# EAGLE design GA144_SRAM_ISI_V2 (EAGLE 5.07)
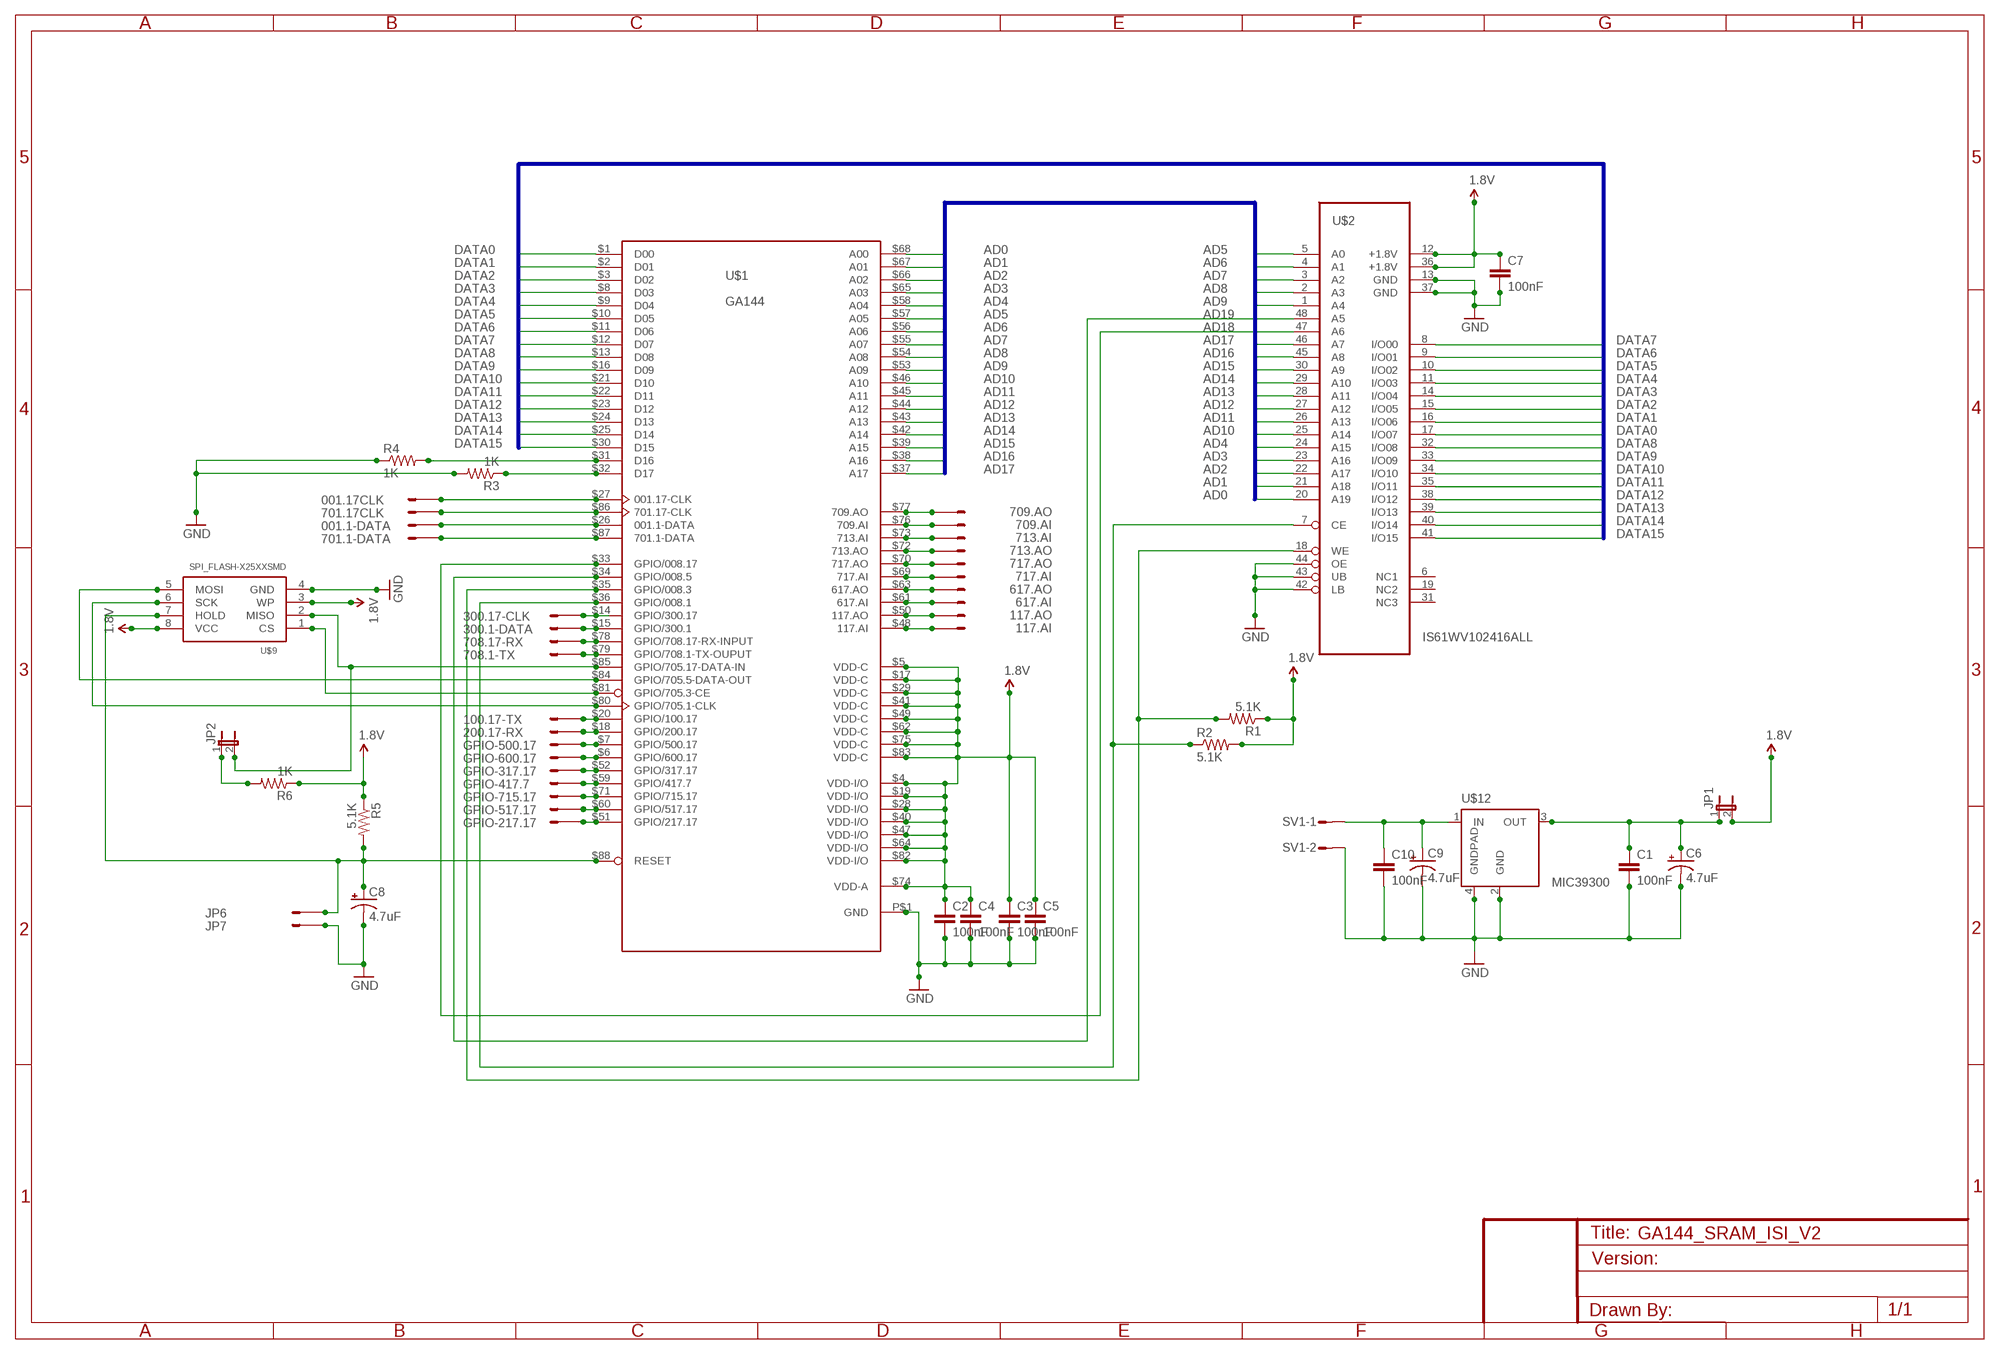
[diagram p0: schematic, sheet 1]

## Parts
001.1-DATA  M01PTH_LONGPAD  [1X01_LONGPAD]
001.17CLK  M01PTH_LONGPAD  [1X01_LONGPAD]
100.17-TX  M01PTH_LONGPAD  [1X01_LONGPAD]
117.AI  M01PTH_LONGPAD  [1X01_LONGPAD]
117.AO  M01PTH_LONGPAD  [1X01_LONGPAD]
200.17-RX  M01PTH_LONGPAD  [1X01_LONGPAD]
300.1-DATA  M01PTH_LONGPAD  [1X01_LONGPAD]
300.17-CLK  M01PTH_LONGPAD  [1X01_LONGPAD]
617.AI  M01PTH_LONGPAD  [1X01_LONGPAD]
617.AO  M01PTH_LONGPAD  [1X01_LONGPAD]
701.1-DATA  M01PTH_LONGPAD  [1X01_LONGPAD]
701.17CLK  M01PTH_LONGPAD  [1X01_LONGPAD]
708.1-TX  M01PTH_LONGPAD  [1X01_LONGPAD]
708.17-RX  M01PTH_LONGPAD  [1X01_LONGPAD]
709.AI  M01PTH_LONGPAD  [1X01_LONGPAD]
709.AO  M01PTH_LONGPAD  [1X01_LONGPAD]
713.AI  M01PTH_LONGPAD  [1X01_LONGPAD]
713.AO  M01PTH_LONGPAD  [1X01_LONGPAD]
717.AI  M01PTH_LONGPAD  [1X01_LONGPAD]
717.AO  M01PTH_LONGPAD  [1X01_LONGPAD]
C1  100nF  CAP1210  [1210]
C2  100nF  CAP0402-CAP  [0402-CAP]
C3  100nF  CAP0402-CAP  [0402-CAP]
C4  100nF  CAP0402-CAP  [0402-CAP]
C5  100nF  CAP0402-CAP  [0402-CAP]
C6  4.7uF  CAP_POLSMD  [VISHAY_C]
C7  100nF  CAP1210  [1210]
C8  4.7uF  CAP_POLSMD  [VISHAY_C]
C9  4.7uF  CAP_POLSMD  [VISHAY_C]
C10  100nF  CAP1210  [1210]
GPIO-217.17  M01PTH_LONGPAD  [1X01_LONGPAD]
GPIO-317.17  M01PTH_LONGPAD  [1X01_LONGPAD]
GPIO-417.7  M01PTH_LONGPAD  [1X01_LONGPAD]
GPIO-500.17  M01PTH_LONGPAD  [1X01_LONGPAD]
GPIO-517.17  M01PTH_LONGPAD  [1X01_LONGPAD]
GPIO-600.17  M01PTH_LONGPAD  [1X01_LONGPAD]
GPIO-715.17  M01PTH_LONGPAD  [1X01_LONGPAD]
JP1  JP1E  [JP1]
JP2  JP1E  [JP1]
JP6  M01PTH_LONGPAD  [1X01_LONGPAD]
JP7  M01PTH_LONGPAD  [1X01_LONGPAD]
R1  5.1K  RESISTOR1206  [1206]
R2  5.1K  RESISTOR1206  [1206]
R3  1K  RESISTOR1206  [1206]
R4  1K  RESISTOR1206  [1206]
R5  5.1K  RESISTOR1206  [1206]
R6  1K  RESISTOR1206  [1206]
SV1  L02P  [L02P]
U$1  GA144  GA144_NEW  [QFN88-0.4MM]
U$2  IS61WV102416ALL  [TSOP-48]
U$9  SPI_FLASH-X25XXSMD  [SO08]
U$12  MIC39300  [TO263-3]

## Nets
1.8V: C2.1 C3.1 C4.1 C5.1 C7.1 JP1.2 R1.1 R2.2 R5.1 R6.1 U$1.$4(VDD-I/O) U$1.$5(VDD-C) U$1.$17(VDD-C) U$1.$19(VDD-I/O) U$1.$28(VDD-I/O) U$1.$29(VDD-C) U$1.$40(VDD-I/O) U$1.$41(VDD-C) U$1.$47(VDD-I/O) U$1.$49(VDD-C) U$1.$62(VDD-C) U$1.$64(VDD-I/O) U$1.$74(VDD-A) U$1.$75(VDD-C) U$1.$82(VDD-I/O) U$1.$83(VDD-C) U$2.12(+1.8V) U$2.36(+1.8V) U$9.3(WP) U$9.8(VCC)
AD0: U$1.$68(A00) U$2.20(A19)
AD1: U$1.$67(A01) U$2.21(A18)
AD2: U$1.$66(A02) U$2.22(A17)
AD3: U$1.$65(A03) U$2.23(A16)
AD4: U$1.$58(A04) U$2.24(A15)
AD5: U$1.$57(A05) U$2.5(A0)
AD6: U$1.$56(A06) U$2.4(A1)
AD7: U$1.$55(A07) U$2.3(A2)
AD8: U$1.$54(A08) U$2.2(A3)
AD9: U$1.$53(A09) U$2.1(A4)
AD10: U$1.$46(A10) U$2.25(A14)
AD11: U$1.$45(A11) U$2.26(A13)
AD12: U$1.$44(A12) U$2.27(A12)
AD13: U$1.$43(A13) U$2.28(A11)
AD14: U$1.$42(A14) U$2.29(A10)
AD15: U$1.$39(A15) U$2.30(A9)
AD16: U$1.$38(A16) U$2.45(A8)
AD17: U$1.$37(A17) U$2.46(A7)
AD18: U$1.$33(GPIO/008.17) U$2.47(A6)
AD19: U$1.$34(GPIO/008.5) U$2.48(A5)
DATA0: U$1.$1(D00) U$2.17(I/O07)
DATA1: U$1.$2(D01) U$2.16(I/O06)
DATA2: U$1.$3(D02) U$2.15(I/O05)
DATA3: U$1.$8(D03) U$2.14(I/O04)
DATA4: U$1.$9(D04) U$2.11(I/O03)
DATA5: U$1.$10(D05) U$2.10(I/O02)
DATA6: U$1.$11(D06) U$2.9(I/O01)
DATA7: U$1.$12(D07) U$2.8(I/O00)
DATA8: U$1.$13(D08) U$2.32(I/O08)
DATA9: U$1.$16(D09) U$2.33(I/O09)
DATA10: U$1.$21(D10) U$2.34(I/O10)
DATA11: U$1.$22(D11) U$2.35(I/O11)
DATA12: U$1.$23(D12) U$2.38(I/O12)
DATA13: U$1.$24(D13) U$2.39(I/O13)
DATA14: U$1.$25(D14) U$2.40(I/O14)
DATA15: U$1.$30(D15) U$2.41(I/O15)
GND: C1.2 C2.2 C3.2 C4.2 C5.2 C6.- C7.2 C8.- C9.- C10.2 JP7.1 R3.2 R4.1 SV1.2 U$1.P$1(GND) U$2.13(GND) U$2.37(GND) U$2.42(LB) U$2.43(UB) U$2.44(OE) U$9.4(GND) U$12.2(GND) U$12.4(GNDPAD)
N$1: JP2.1 R6.2
N$4: R1.2 U$1.$35(GPIO/008.3) U$2.18(WE)
N$5: R2.1 U$1.$36(GPIO/008.1) U$2.7(CE)
N$6: R3.1 U$1.$32(D17)
N$7: R4.2 U$1.$31(D16)
N$8: C8.+ JP6.1 R5.2 U$1.$88(RESET) U$9.7(HOLD)
N$9: U$1.$81(GPIO/705.3-CE) U$9.1(CS)
N$10: JP2.2 U$1.$85(GPIO/705.17-DATA-IN) U$9.2(MISO)
N$11: U$1.$84(GPIO/705.5-DATA-OUT) U$9.5(MOSI)
N$12: U$1.$80(GPIO/705.1-CLK) U$9.6(SCK)
N$13: 701.17CLK.1 U$1.$86(701.17-CLK)
N$14: C9.+ C10.1 SV1.1 U$12.1(IN)
N$15: C1.1 C6.+ JP1.1 U$12.3(OUT)
N$16: 709.AI.1 U$1.$76(709.AI)
N$17: 709.AO.1 U$1.$77(709.AO)
N$18: 713.AI.1 U$1.$73(713.AI)
N$19: 713.AO.1 U$1.$72(713.AO)
N$20: 717.AO.1 U$1.$70(717.AO)
N$21: 717.AI.1 U$1.$69(717.AI)
N$22: 617.AO.1 U$1.$63(617.AO)
N$23: 617.AI.1 U$1.$61(617.AI)
N$24: 117.AO.1 U$1.$50(117.AO)
N$25: 117.AI.1 U$1.$48(117.AI)
N$26: 001.17CLK.1 U$1.$27(001.17-CLK)
N$27: 001.1-DATA.1 U$1.$26(001.1-DATA)
N$28: 300.17-CLK.1 U$1.$14(GPIO/300.17)
N$29: 701.1-DATA.1 U$1.$87(701.1-DATA)
N$30: 300.1-DATA.1 U$1.$15(GPIO/300.1)
N$31: 708.17-RX.1 U$1.$78(GPIO/708.17-RX-INPUT)
N$32: 708.1-TX.1 U$1.$79(GPIO/708.1-TX-OUPUT)
N$33: 100.17-TX.1 U$1.$20(GPIO/100.17)
N$34: 200.17-RX.1 U$1.$18(GPIO/200.17)
N$35: GPIO-500.17.1 U$1.$7(GPIO/500.17)
N$36: GPIO-600.17.1 U$1.$6(GPIO/600.17)
N$37: GPIO-317.17.1 U$1.$52(GPIO/317.17)
N$38: GPIO-417.7.1 U$1.$59(GPIO/417.7)
N$39: GPIO-715.17.1 U$1.$71(GPIO/715.17)
N$40: GPIO-517.17.1 U$1.$60(GPIO/517.17)
N$41: GPIO-217.17.1 U$1.$51(GPIO/217.17)
Unconnected: U$2.6(NC1) U$2.19(NC2) U$2.31(NC3)

## Buses
DATA[0..15]
AD[0..19]

## Library data of the parts
001.1-DATA 001.17CLK 100.17-TX 117.AI 117.AO 200.17-RX 300.1-DATA 300.17-CLK 617.AI 617.AO 701.1-DATA 701.17CLK 708.1-TX 708.17-RX 709.AI 709.AO 713.AI 713.AO 717.AI 717.AO GPIO-217.17 GPIO-317.17 GPIO-417.7 GPIO-500.17 GPIO-517.17 GPIO-600.17 GPIO-715.17 JP6 JP7 = ga144:M01: Header 1 Standard 1-pin 0.1" header. Use with straight break away headers (SKU : PRT-00116), right angle break away headers (PRT-00553), swiss pins (PRT-00743), machine pins (PRT-00117), and female headers (PRT-00115).
C1-C5 C7 C10 = SparkFun:CAP: Capacitor Standard 0603 ceramic capacitor, and 0.1" leaded capacitor.
C6 C8 C9 = SparkFun:CAP_POL: Capacitor Polarized These are standard SMD and PTH capacitors. Normally 10uF, 47uF, and 100uF in electrolytic and tantalum varieties. Always verify the external diameter of the through hole cap, it varies with capacity, voltage, and manufacturer. The EIA devices should be standard.
JP1 JP2 = jumper:JP1E: JUMPER
R1-R6 = QFN:RESISTOR: Resistor Basic schematic elements and footprints for 0603, 1206, and PTH 1/10th watt (small) resistors.
SV1 = con-amp-mt:L02P: AMP MT CONNECTOR; OC_FARNELL: unknown; OC_NEWARK: unknown
U$1 = ga144:GA144_NEW: Parallel Processing for Embedded Systems The GA144 measures just 1cm x 1cm. It integrates 144 F18A computers in an 18 x 8 array. # Each of its F18A computers can perform a basic ALU function in about 1.5 nanoseconds while only consuming about 7 picojoules. http://greenarraychips.com/ library GA144 eagle : http://esaid.free.fr/
U$2 = ga144:IS61WV102416ALL: IS61WV102416ALL SRAM 1.8V 20ns
U$9 = SparkFun:SPI_FLASH-X25XX: 8pin SPI Flash series x25xx. Works with devices like W25X32 and BR25L32
U$12 = v-reg-micrel:MIC39300: MIC39300 LDO regulateur MICREL : www.micrel.com/_PDF/mic39300.pdf

## Board
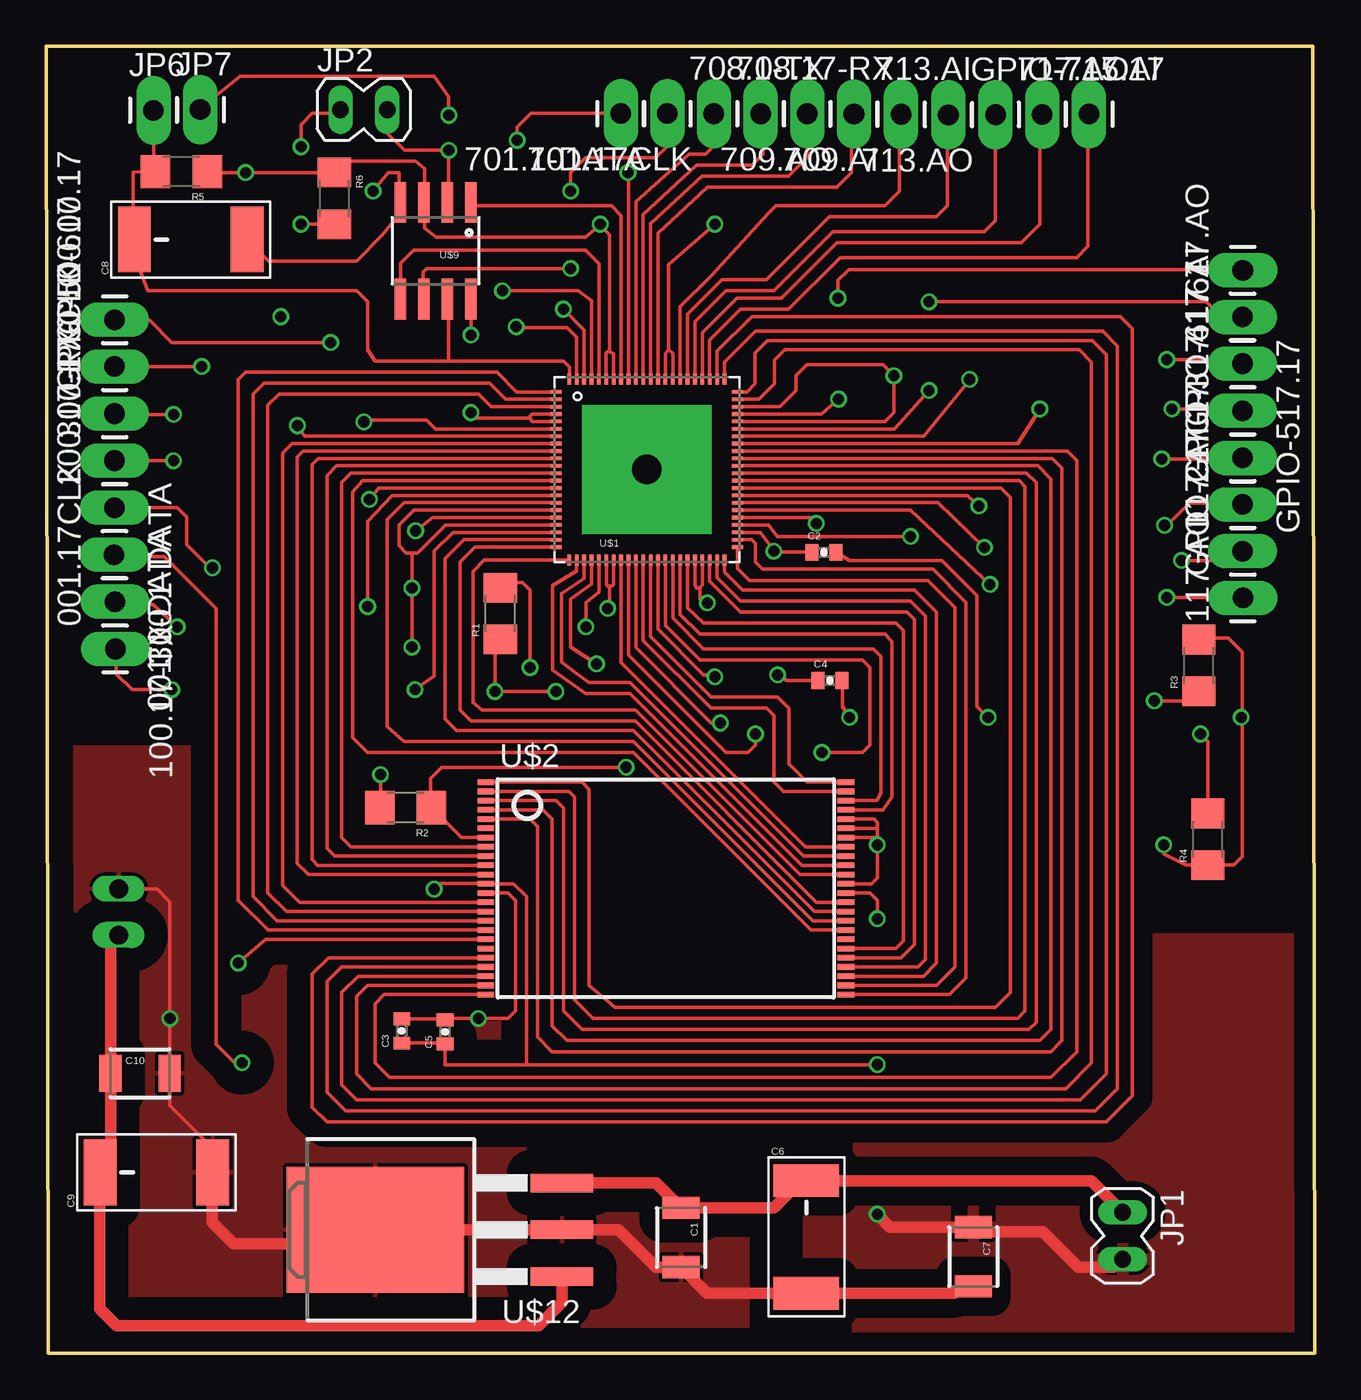
[diagram p1: board, top side]
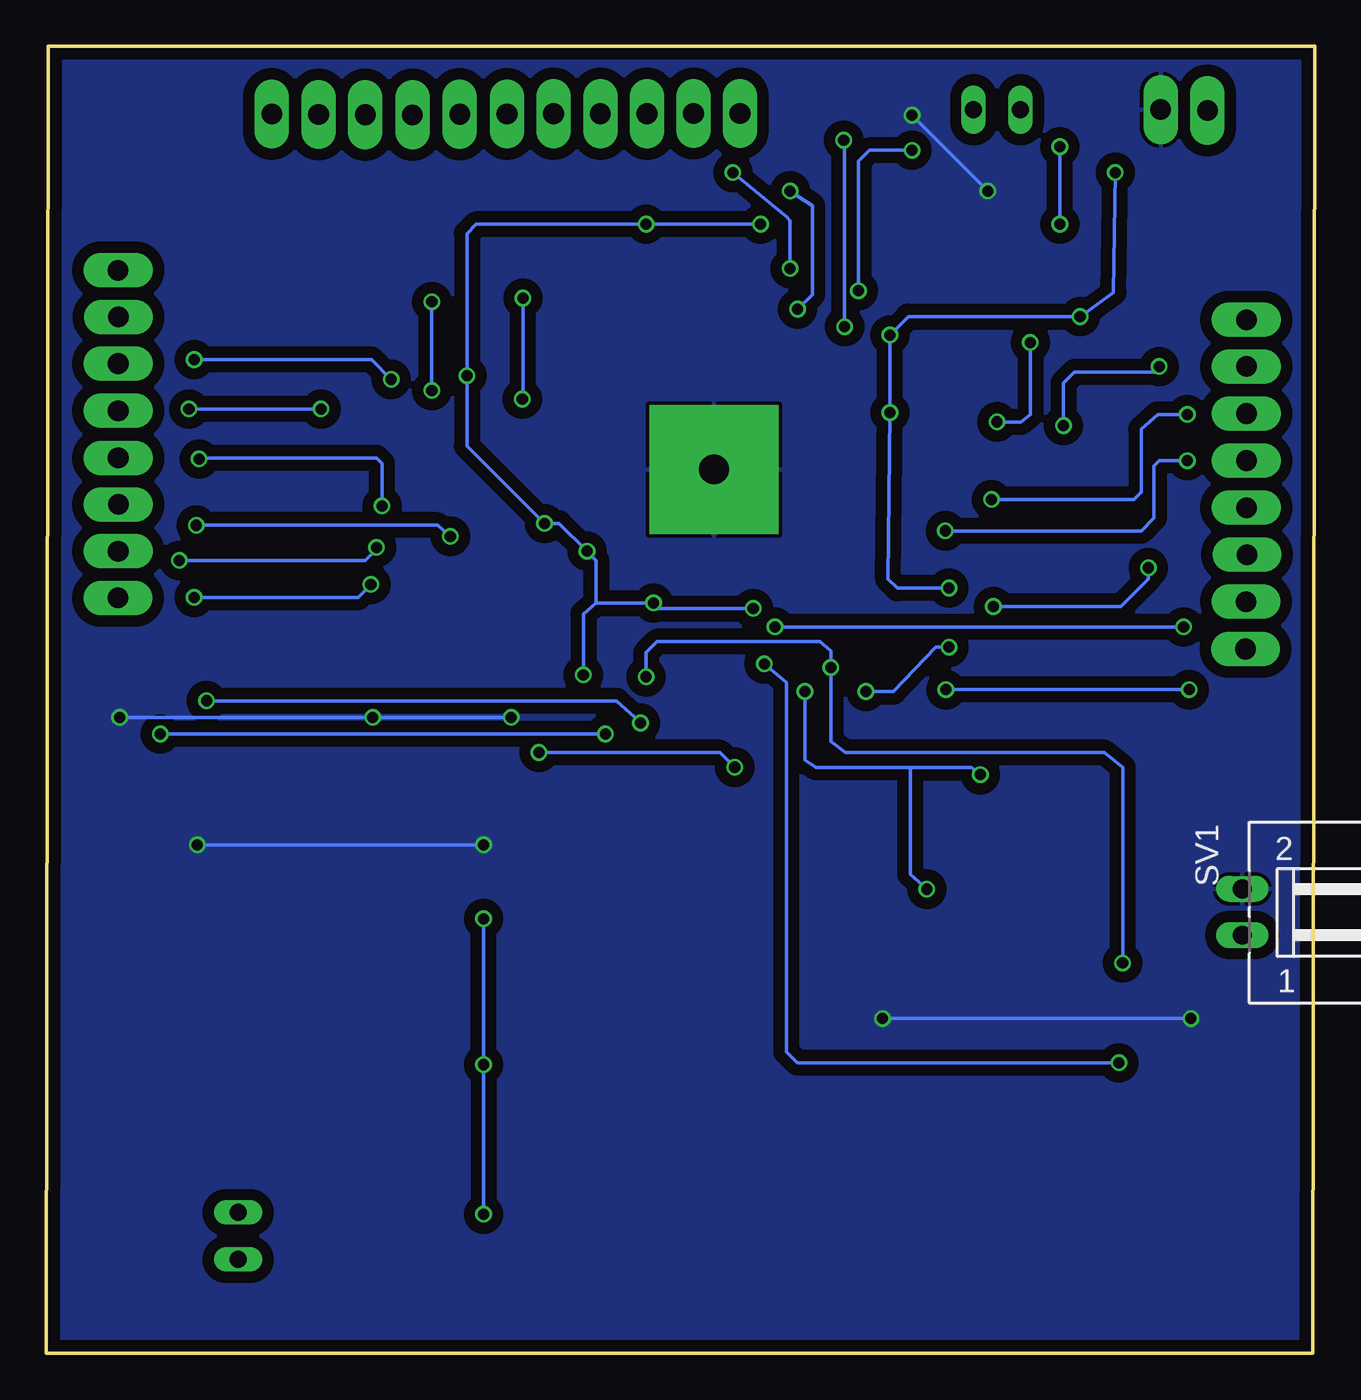
[diagram p2: board, bottom side, seen from below]

Size 68.68 x 70.77 mm. Coordinates in mm from the lower left corner, seen from the top.
Outline: 0,70.77 68.58,70.77 68.68,0 0.1,0 0,70.77
Copper layers (1*16): Top 0.035mm / dielectric 1.5mm / Bottom 0.035mm
Design rules "PCB-POOL Standard": minimum track width 0.15mm, minimum drill 0.3mm, track to track 0.15mm, track to pad 0.15mm, pad to pad 0.15mm, via to via 0.15mm, smd to smd 0.15mm, copper to edge 0.3mm, drill to drill 0.2mm, minimum pad ring 0.2mm, minimum via ring 0.15mm, stop-mask expansion 0.075mm, vias tented up to drill 0mil, thermal gap 0.2mm

### Footprints (pad centres in the part's own frame; a part is rotated, then mirrored left to right if it is on the bottom)
1X01_LONGPAD = drill 1.118 pad 1.88 long: 1 0,0
1210 = smd 1.2 x 2: 1 -1.6,0; 2 1.6,0
0402-CAP = smd 0.7 x 0.9: 1 -0.65,0; 2 0.65,0
VISHAY_C = smd 3.556 x 1.778: + 0,3.048; - 0,-3.048
JP1 = drill 0.914 long: 1 0,-1.27; 2 0,1.27
1206 = smd 1.6 x 1.8: 1 -1.4,0; 2 1.4,0
L02P = drill 1.016 long: 1 1.25,-6.25; 2 -1.25,-6.25
QFN88-0.4MM = smd 0.6 x 0.2: $1 -5.21,4.3; $2 -5.21,3.9; $3 -5.21,3.5; $4 -5.21,3.1; $5 -5.21,2.7; $6 -5.21,2.3; $7 -5.21,1.9; $8 -5.21,1.5; $9 -5.21,1.1; $10 -5.21,0.7; $11 -5.21,0.3; $12 -5.21,-0.1; $13 -5.21,-0.5; $14 -5.21,-0.9; $15 -5.21,-1.3; $16 -5.21,-1.7; $17 -5.21,-2.1; $18 -5.21,-2.5; $19 -5.21,-2.9; $20 -5.21,-3.3; $21 -5.21,-3.7; $22 -5.21,-4.1; $45 4.61,-4.1; $46 4.61,-3.7; $47 4.61,-3.3; $48 4.61,-2.9; $49 4.61,-2.5; $50 4.61,-2.1; $51 4.61,-1.7; $52 4.61,-1.3; $53 4.61,-0.9; $54 4.61,-0.5; $55 4.61,-0.1; $56 4.61,0.3; $57 4.61,0.7; $58 4.61,1.1; $59 4.61,1.5; $60 4.61,1.9; $61 4.61,2.3; $62 4.61,2.7; $63 4.61,3.1; $64 4.61,3.5; $65 4.61,3.9; $66 4.61,4.3 | smd 0.2 x 0.6: $23 -4.5,-4.81; $24 -4.1,-4.81; $25 -3.7,-4.81; $26 -3.3,-4.81; $27 -2.9,-4.81; $28 -2.5,-4.81; $29 -2.1,-4.81; $30 -1.7,-4.81; $31 -1.3,-4.81; $32 -0.9,-4.81; $33 -0.5,-4.81; $34 -0.1,-4.81; $35 0.3,-4.81; $36 0.7,-4.81; $37 1.1,-4.81; $38 1.5,-4.81; $39 1.9,-4.81; $40 2.3,-4.81; $41 2.7,-4.81; $42 3.1,-4.81; $43 3.5,-4.81; $44 3.9,-4.81; $67 3.9,4.99; $68 3.5,4.99; $69 3.1,4.99; $70 2.7,4.99; $71 2.3,4.99; $72 1.9,4.99; $73 1.5,4.99; $74 1.1,4.99; $75 0.7,4.99; $76 0.3,4.99; $77 -0.1,4.99; $78 -0.5,4.99; $79 -0.9,4.99; $80 -1.3,4.99; $81 -1.7,4.99; $82 -2.1,4.99; $83 -2.5,4.99; $84 -2.9,4.99; $85 -3.3,4.99; $86 -3.7,4.99; $87 -4.1,4.99; $88 -4.5,4.99 | drill 1.6 pad 7 square: P$1 -0.3,0.1
TSOP-48 = smd 0.9 x 0.3: 1 -3.4,8.29; 2 -3.4,7.79; 3 -3.4,7.29; 4 -3.4,6.79; 5 -3.4,6.29; 6 -3.4,5.79; 7 -3.4,5.29; 8 -3.4,4.79; 9 -3.4,4.29; 10 -3.4,3.79; 11 -3.4,3.29; 12 -3.4,2.79; 13 -3.4,2.29; 14 -3.4,1.79; 15 -3.4,1.29; 16 -3.4,0.79; 17 -3.4,0.29; 18 -3.4,-0.21; 19 -3.4,-0.71; 20 -3.4,-1.21; 21 -3.4,-1.71; 22 -3.4,-2.21; 23 -3.4,-2.71; 24 -3.4,-3.21; 25 16.1,-3.21; 26 16.1,-2.71; 27 16.1,-2.21; 28 16.1,-1.71; 29 16.1,-1.21; 30 16.1,-0.71; 31 16.1,-0.21; 32 16.1,0.29; 33 16.1,0.79; 34 16.1,1.29; 35 16.1,1.79; 36 16.1,2.29; 37 16.1,2.79; 38 16.1,3.29; 39 16.1,3.79; 40 16.1,4.29; 41 16.1,4.79; 42 16.1,5.29; 43 16.1,5.79; 44 16.1,6.29; 45 16.1,6.79; 46 16.1,7.29; 47 16.1,7.79; 48 16.1,8.29
SO08 = smd 0.61 x 2.21: 1 -1.905,-2.616; 2 -0.635,-2.616; 3 0.635,-2.616; 4 1.905,-2.616; 5 1.905,2.616; 6 0.635,2.616; 7 -0.635,2.616; 8 -1.905,2.616
TO263-3 = smd 1 x 3.4: 1 -3.81,-6.6; 2 -1.27,-6.6; 3 1.27,-6.6 | smd 6.8 x 9.6: 4 -1.27,3.5

### Placement (x,y rotation side)
001.1-DATA  3.67,43.24 270 top
001.17CLK  3.72,40.7 90 top
100.17-TX  3.75,38.13 270 top
117.AI  64.78,45.96 90 top
117.AO  64.8,40.91 90 top
200.17-RX  3.7,48.33 90 top
300.1-DATA  3.7,45.78 270 top
300.17-CLK  3.7,50.88 90 top
617.AI  64.77,56.11 90 top
617.AO  64.78,58.64 90 top
701.1-DATA  31.11,67.12 180 top
701.17CLK  33.63,67.12 180 top
708.1-TX  36.15,67.11 0 top
708.17-RX  38.68,67.11 0 top
709.AI  43.73,67.09 180 top
709.AO  41.21,67.11 180 top
713.AI  46.28,67.08 0 top
713.AO  48.85,67.05 180 top
717.AI  56.46,67.09 0 top
717.AO  53.92,67.08 0 top
C1  34.37,6.28 270 top
C2  42.11,43.37 0 top
C3  19.25,17.45 90 top
C4  42.45,36.43 0 top
C5  21.6,17.4 90 top
C6  41.15,6.3 0 top
C7  50.2,5.23 270 top
C8  7.83,60.3 90 top
C9  5.97,9.8 90 top
C10  5.08,15.16 0 top
GPIO-217.17  64.78,43.43 90 top
GPIO-317.17  64.78,48.48 90 top
GPIO-417.7  64.78,51.03 90 top
GPIO-500.17  3.7,53.43 90 top
GPIO-517.17  64.78,53.58 270 top
GPIO-600.17  3.7,55.96 90 top
GPIO-715.17  51.4,67.06 0 top
JP1  58.28,6.36 180 top
JP2  17.2,67.33 270 top
JP6  5.81,67.3 0 top
JP7  8.34,67.33 0 top
R1  24.59,40.05 90 top
R2  19.46,29.54 180 top
R3  62.41,37.24 90 top
R4  62.9,27.83 90 top
R5  7.32,63.98 180 top
R6  15.6,62.53 270 top
SV1  -2.33,23.89 270 bottom
U$1  32.83,47.75 0 top
U$2  27.2,22.63 0 top
U$9  21.09,59.69 180 top
U$12  21.32,7.96 90 top

### Tracks (layer width: path | path; a pad name or v marks a point on that pad's centre or on a via)
1.8V  (via drill 0.6)
  Top 0.2: U$1.$64 39.72,51.25 40.6,52.13 40.6,52.93 41.2,53.53 45.3,53.53 v45.9,52.93 45.9,50.93 45.42,50.45 U$1.$62 | U$1.$47 38.68,44.45 39.45,43.38 | 41.4,43.53 C2.1 41.25,43.38 39.45,43.38 | U$9.3 20.5,62.86 20.5,64.13 20,64.53 15.6,64.53 R6.1 | 15.25,64.28 15.05,64.48 | 15.25,64.28 R6.1 | U$9.3 20.4,62.33 | 26.2,50.63 26.31,50.45 U$1.$5 | 26.2,50.63 26.2,50.73 26.3,50.85 U$1.$4 | 30.5,54.23 30.72,54.13 30.72,52.83 U$1.$82 | 30.5,54.23 30.4,54.23 30.32,54.14 30.32,52.84 U$1.$83 | 33.7,54.33 33.93,54.13 33.93,52.83 U$1.$74 | 33.7,54.33 33.53,54.13 33.53,52.83 U$1.$75 | 35.4,41.43 35.2,41.43 35.12,41.63 U$1.$40 | U$1.$41 35.53,41.63 35.4,41.43 | 30.65,41.58 30.6,41.53 30.5,41.53 | 30.65,41.58 30.73,41.63 U$1.$29 | 30.5,41.53 30.4,41.53 30.33,41.63 U$1.$28 | R6.1 15.55,63.98 | v23,55.13 23,56.93 U$9.8 | v23,50.93 23.3,50.63 26.2,50.63 | R5.1 8.8,63.93 v10.8,63.93 14.9,63.93 15.25,64.28 | 30.5,54.23 30.5,60.53 v30,61.13 29.9,61.03 29.2,60.43 21.1,60.43 20.5,60.93 20.5,62.23 U$9.3 | v36.2,61.13 33.7,58.93 33.7,54.33 | U$1.$19 21.62,44.85 20.1,43.33 19.8,43.33 | U$1.$17 19.92,45.65 19.1,44.83 19.1,43.73 19.5,43.33 19.8,43.33 | v39.6,36.73 40.1,36.43 C4.1 | 35.4,41.43 35.4,40.83 v35.8,40.63 | 30.5,41.53 30.5,40.46 v30.4,40.33 | 30.5,41.53 30.65,41.58 | 26,15.63 26,24.73 25.31,25.42 U$2.12 21.3,25.43 v21,25.13 | 26,15.63 21.6,15.63 C5.1 21.55,16.8 C3.1 | v45,23.53 45,24.53 44.6,24.93 43.4,24.93 U$2.36 | v19.8,38.23 v19.8,41.43 19.8,43.33 | v27.6,35.83 v24.3,35.83 24.3,38.36 R1.1 | v18.1,31.33 18.1,29.63 R2.2 | v39.4,43.43 39.45,43.38 | U$1.$49 41.5,45.25 41.7,45.03 v41.7,44.93 | 26,15.63 v45,15.63
  Top 0.61: JP1.2 57.78,4.67 55.88,4.67 53.98,6.57 50.8,6.57 C7.1 45.7,6.84 v45,7.53
  Bottom 0.2: v10.8,63.93 10.9,57.43 v12.7,56.13 22,56.13 v23,55.13 v23,50.93 23.1,41.93 22.6,41.43 v19.8,41.43 | v39.6,36.73 39.6,40.03 38.9,40.63 | 38.9,40.63 v35.8,40.63 35.5,40.33 v30.4,40.33 | v45,7.53 v45,15.63 v45,23.53 | v19.8,38.23 20.5,38.23 22.8,35.83 v24.3,35.83 | v27.6,35.83 27.6,32.13 27,31.73 21.9,31.73 | 21.9,31.73 18.6,31.73 v18.1,31.33 | 38.9,40.63 38.9,42.93 v39.4,43.43 40.9,44.93 v41.7,44.93 45.9,49.13 v45.9,52.93 45.9,60.63 45.4,61.13 v36.2,61.13 v30,61.13 | 21.9,31.73 21.9,25.93 v21,25.13
  pour Top (isolate 1.016): 67.94,0.22 67.94,22.45 42.55,22.45 41.27,21.17 41.27,0.86 41.91,0.22
AD0
  Top 0.2: U$2.20 15.29,21.42 14.4,20.53 14.4,13.33 15.2,12.53 57.4,12.53 58.8,13.93 58.8,55.48 58.15,56.13 38.2,56.13 36.33,54.25 U$1.$68
AD1
  Top 0.2: U$1.$67 36.73,53.66 38.4,55.33 57.2,55.33 58,54.53 58,14.33 56.8,13.13 16.2,13.13 15.2,14.13 15.2,20.13 15.99,20.92 U$2.21
AD2
  Top 0.2: U$2.22 16.89,20.42 16,19.53 16,14.53 16.8,13.73 56,13.73 57.4,15.13 57.4,54.07 56.64,54.83 39.04,54.83 38.37,54.16 38.37,52.49 37.93,52.05 U$1.$66
AD3
  Top 0.2: U$2.23 17.39,19.92 16.8,19.33 16.8,15.13 17.6,14.33 55.2,14.33 56.6,15.73 56.6,53.67 55.94,54.33 40,54.33 39.44,53.77 39.44,52.49 38.6,51.65 U$1.$65
AD4
  Top 0.2: U$2.24 18.29,19.42 17.8,18.93 17.8,15.73 18.6,14.93 54.4,14.93 55.8,16.33 55.8,48.33 55.28,48.85 U$1.$58
AD5
  Top 0.2: U$2.5 26.21,28.92 26.6,28.53 26.6,17.13 27.4,16.33 54.4,16.33 55,16.93 55,47.93 54.48,48.45 U$1.$57
AD6
  Top 0.2: U$1.$56 53.68,48.05 54.4,47.33 54.4,17.53 53.8,16.93 28.2,16.93 27.4,17.73 27.4,28.93 26.91,29.42 U$2.4
AD7
  Top 0.2: U$2.3 27.61,29.92 28,29.53 28,18.53 29,17.53 53.2,17.53 53.6,17.93 53.6,47.13 53.08,47.65 U$1.$55
AD8
  Top 0.2: U$1.$54 52.68,47.25 53,46.93 53,18.53 52.6,18.13 29.6,18.13 28.6,19.13 28.6,30.13 28.31,30.42 U$2.2
AD9
  Top 0.2: U$2.1 29.01,30.92 29.4,30.53 29.4,19.93 30.8,18.73 51.4,18.73 52.2,19.53 52.2,46.33 51.68,46.85 U$1.$53
AD10
  Top 0.2: U$2.25 48.89,19.42 49.8,20.33 49.8,40.66 48.01,42.45 38.78,42.45 38.4,42.83 38.4,43.83 38.18,44.05 U$1.$46
AD11
  Top 0.2: U$1.$45 37.44,42.49 38.08,41.85 47.74,41.85 49.2,40.39 49.2,20.93 48.19,19.92 U$2.26
AD12
  Top 0.2: U$1.$44 36.73,42.3 37.7,41.33 47,41.33 48.2,40.13 48.2,21.13 47.49,20.42 U$2.27
AD13
  Top 0.2: U$1.$43 36.33,42 37.6,40.73 46.8,40.73 47.6,39.93 47.6,21.33 47.19,20.92 U$2.28
AD14
  Top 0.2: U$1.$42 35.92,41.8 37.6,40.13 46.6,40.13 47,39.73 47,22.13 46.29,21.42 U$2.29
AD15
  Top 0.2: U$1.$39 34.73,40.35 35.6,39.53 46,39.53 46.4,39.13 46.4,22.33 46,21.93 U$2.30
AD16
  Top 0.2: U$1.$38 34.33,40 35.4,38.93 45.4,38.93 45.8,38.53 45.8,30.13 45.29,29.42 U$2.45
AD17
  Top 0.2: U$1.$37 33.92,39.8 35.6,38.13 44.8,38.13 45.2,37.73 45.2,30.33 44.99,29.92 U$2.46
AD18
  Top 0.2: U$2.47 39.91,30.42 39.4,30.93 39.4,34.53 39,34.93 36,34.93 32.33,38.6 U$1.$33
AD19
  Top 0.2: U$1.$34 32.73,38.8 36,35.53 39.6,35.53 40.21,34.92 40.21,31.92 41.2,30.93 41.4,30.93 U$2.48
DATA0
  Top 0.2: U$2.17 12.01,22.92 10.4,24.53 10.4,52.73 10.8,53.13 24.4,53.13 25.48,52.05 U$1.$1
DATA1
  Top 0.2: U$2.16 12.51,23.42 11.2,24.73 11.2,51.93 11.8,52.53 24,52.53 24.88,51.65 U$1.$2
DATA2
  Top 0.2: U$1.$3 24.08,51.25 23.4,51.93 12.6,51.93 12,51.33 12,24.93 13.01,23.92 U$2.15
DATA3
  Top 0.2: U$1.$8 13.32,49.25 12.8,48.73 12.8,25.33 13.71,24.42 U$2.14
DATA4
  Top 0.2: U$1.$9 13.92,48.85 13.6,48.53 13.6,26.53 14.21,25.92 U$2.11
DATA5
  Top 0.2: U$1.$10 14.72,48.45 14.4,48.13 14.4,26.73 14.71,26.42 U$2.10
DATA6
  Top 0.2: U$1.$11 15.72,48.05 15.2,47.53 15.2,27.33 15.61,26.92 U$2.9
DATA7
  Top 0.2: U$1.$12 16.52,47.65 16,47.13 16,27.93 16.51,27.42 U$2.8
DATA8
  Top 0.2: U$1.$13 17.12,47.25 16.6,46.63 16.6,33.33 17.4,32.53 31.8,32.53 41.4,22.93 43.2,22.93 U$2.32
DATA9
  Top 0.2: U$1.$16 19.39,46.05 18.47,45.13 18.47,33.93 19.37,33.13 31.8,33.13 41.51,23.42 U$2.33
DATA10
  Top 0.2: U$1.$21 22.63,44.05 21.61,43.03 21.61,34.33 22.21,33.73 31.8,33.73 41.6,23.93 43.2,23.93 U$2.34
DATA11
  Top 0.2: U$1.$22 23.23,43.65 22.41,42.83 22.41,34.83 23.01,34.23 31.9,34.23 41.71,24.42 U$2.35
DATA12
  Top 0.2: U$1.$23 23.72,42.94 23.11,42.33 23.11,35.23 23.61,34.83 31.9,34.83 40.81,25.92 U$2.38
DATA13
  Top 0.2: U$1.$24 28.73,42.35 27.43,41.55 27.43,37 29.2,35.73 31.6,35.73 40.91,26.42 U$2.39
DATA14
  Top 0.2: U$1.$25 29.12,41.95 27.9,41.13 27.9,37.43 28.73,36.8 29.4,36.33 31.6,36.33 41.01,26.92 U$2.40
DATA15
  Top 0.2: U$1.$30 31.12,37.41 41.11,27.42 U$2.41
GND  (via drill 0.6)
  Top 0.2: U$2.37 44.69,25.42 45,25.73 v45,27.53 45,27.93 | 45,27.93 U$2.42 | U$2.44 44.81,28.92 45,28.73 45,28.53 | 45,27.93 45,28.53 | U$2.43 44.89,28.42 45,28.53 | C1.2 34.23,4.53 | 49.18,3.26 C7.2 | 17.6,6.63 U$12.4 17.4,5.83 16.51,5.83 16.1,5.83 16,5.93 | U$12.2 27.6,6.63 | 9,8.63 9,9.73 C9.- 9,9.83 9,11.13 6.7,13.43 6.7,15.93 C10.2 6.68,18.13 | 6.68,18.13 6.68,24.45 6,25.13 3.94,25.13 SV1.2 3.81,25.26 | 64.77,34.43 64.77,26.89 64.31,26.43 R4.1 61.7,26.43 60.5,27.03 v60.5,27.53 | 64.77,34.43 64.77,37.96 64,38.73 62.49,38.73 R3.2 | U$2.13 25,24.93 25.4,24.53 25.4,18.53 25,18.13 v23.4,18.13 21.6,18.13 C5.2 21.55,18.09 C3.2 | C2.2 43.5,42.93 48.5,42.93 50.4,41.03 50.4,35.03 v51,34.43 | v43.5,34.43 43.1,35.03 C4.2 | 6.68,18.13 v6.7,18.13 | 64.77,34.43 v64.7,34.43 | JP7.1 8.4,67.43 10.5,69.13 21,69.13 21.8,68.03 v21.8,67.03 | v17.7,62.93 18.5,63.93 19.1,63.93 19.1,62.33 U$9.4 19.16,61.73 18.2,60.53 16.8,59.13 12.04,59.13 C8.-
  Top 0.61: 49.18,3.26 C6.- 35.79,3.26 C1.2 34.36,4.67 33.02,4.67 31,6.69 U$12.2 U$12.4 | 9,8.63 9,7.1 10.16,5.94 16.41,5.94 16.51,5.83
  Bottom 0.2: v43.5,34.43 v51,34.43 v64.7,34.43 | v6.7,18.13 v23.4,18.13 | v45,27.53 v60.5,27.53 | v17.7,62.93 v21.8,67.03
  pour Bottom (isolate 0.61): 0.64,70.07 67.94,70.07 67.94,0.86 0.64,0.86
  pour Top (isolate 1.27): 1.04,32.81 37.97,32.81 37.97,1.42 1.04,1.42
N$1  (via drill 0.6)
  Top 0.2: 15.8,67.2 JP2.1 15.8,67.13 14.4,67.13 13.8,66.53 v13.8,65.33 | v13.8,61.13 R6.2
  Bottom 0.2: v13.8,61.13 v13.8,65.33
N$4  (via drill 0.6)
  Top 0.2: U$2.18 11.89,22.42 v10.4,21.13 | U$1.$35 33.12,39.2 35.6,36.73 36.1,36.73 v36.2,36.63 | v26.2,37.13 26.2,41.33 25.8,41.73 24.87,41.73 R1.2
  Bottom 0.2: v10.4,21.13 10.4,31.73 11.4,32.53 25.4,32.53 26.2,33.13 v26.2,37.13 26.2,38.03 26.8,38.53 35.6,38.53 36.2,37.93 v36.2,36.63
N$5  (via drill 0.6)
  Top 0.2: U$2.7 22.48,27.92 R2.1 20.8,29.73 20.8,31.13 21.4,31.73 v31.4,31.73 | U$1.$36 33.52,39.41 35.4,37.53 44.2,37.53 44.6,37.13 44.6,32.93 44.2,32.53 v42,32.53
  Bottom 0.2: v42,32.53 32.2,32.53 v31.4,31.73
N$6  (via drill 0.6)
  Top 0.2: v60,35.33 62.2,35.33 R3.1 | U$1.$32 31.93,38.2 36,34.13 v36.5,34.13
  Bottom 0.2: v36.5,34.13 36.8,34.43 37.8,35.33 v60,35.33
N$7  (via drill 0.6)
  Top 0.2: U$1.$31 31.52,37.8 36.8,32.53 38,32.53 38.4,32.93 v38.4,33.53 | v62.5,33.53 62.9,33.12 R4.2
  Bottom 0.2: v38.4,33.53 v62.5,33.53
N$8
  Top 0.2: U$1.$88 28.32,53.41 28,53.73 21.8,53.73 | U$9.7 21.8,56.95 21.8,53.73 | 21.8,53.73 17.8,53.73 17.4,54.33 17.4,56.93 16.8,57.53 5.5,57.53 4.8,59.43 C8.+ 5.58,60.51 4.7,60.53 4.7,63.96 R5.2 | R5.2 5.8,64.6 | JP6.1 5.81,64.09 R5.2
N$9
  Top 0.2: U$9.1 23.17,62.13 30.6,62.13 31.12,61.61 U$1.$81
N$10  (via drill 0.6)
  Top 0.2: U$1.$85 29.52,57 28.8,57.53 v24.7,57.53 | U$9.2 21.8,62.33 v21.8,65.13 19.4,65.13 18.47,66.06 JP2.2
  Bottom 0.2: v24.7,57.53 24.7,64.53 24.1,65.13 v21.8,65.13
N$11
  Top 0.2: U$1.$84 29.93,59 29.2,59.73 19.9,59.73 19.2,59.03 19.2,57.09 U$9.5
N$12  (via drill 0.6)
  Top 0.2: v28.4,58.73 20.6,58.73 20.4,58.53 20.4,57.13 U$9.6 | U$1.$80 31.52,63.91 v31.5,63.93
  Bottom 0.2: v28.4,58.73 28.4,61.33 28.6,61.53 v31.5,63.93
N$13  (via drill 0.6)
  Top 0.2: U$1.$86 29.12,55.41 v28,56.53 | v28.4,62.93 28.4,63.93 29.2,64.73 33,64.73 33.6,65.33 33.6,66.93 701.17CLK.1 33.6,67.09
  Bottom 0.2: v28.4,62.93 27.2,62.13 27.2,57.33 v28,56.53
N$14
  Top 0.2: 2.9,8.43 2.9,9.73 C9.+ 2.9,9.83 | C10.1 3.5,15.93 | U$12.1 27.9,4.13
  Top 0.61: SV1.1 3.48,22.21 C10.1 3.48,10.36 C9.+ | 2.9,8.43 2.9,2.4 3.81,1.49 26.67,1.49 27.94,2.76 27.94,4.13 U$12.1
N$15
  Top 0.2: 41.93,9.33 C6.+
  Top 0.61: U$12.3 33.02,9.23 C1.1 39.41,7.88 40.64,9.11 41.71,9.11 41.93,9.33 56.58,9.33 JP1.1
N$16
  Top 0.2: 709.AI.1 43.6,66.97 43.6,63.93 42.8,63.13 35.8,63.13 33.12,60.66 U$1.$76
N$17
  Top 0.2: 709.AO.1 41.2,64.73 40.2,63.73 35.5,63.73 32.73,61.16 U$1.$77
N$18
  Top 0.2: U$1.$73 34.33,56.66 36,58.33 39.1,61.73 39.5,62.13 45.4,62.13 46.2,62.93 46.2,67 713.AI.1
N$19
  Top 0.2: U$1.$72 34.73,56.25 36.6,58.13 39,58.13 42.4,61.53 48.2,61.53 48.8,62.13 48.8,67 713.AO.1
N$20
  Top 0.2: U$1.$70 35.52,55.25 37.4,57.13 39.8,57.13 42.8,60.13 52.8,60.13 53.8,61.13 53.8,66.95 717.AO.1
N$21
  Top 0.2: U$1.$69 35.92,54.85 37.6,56.53 40.2,56.53 43,59.33 55.8,59.33 56.4,59.93 56.4,67.03 717.AI.1
N$22  (via drill 0.6)
  Top 0.2: U$1.$63 41.98,50.85 v42.9,51.66 | v42.87,57.13 42.87,58.1 43.45,58.68 64.74,58.68 617.AO.1
  Bottom 0.2: v42.9,51.66 42.87,51.66 v42.87,57.13
N$23  (via drill 0.6)
  Top 0.2: U$1.$61 45.92,50.05 v47.8,52.13 | v47.8,56.93 62.8,56.93 63.6,56.13 64.75,56.13 617.AI.1
  Bottom 0.2: v47.8,52.13 v47.8,56.93
N$24  (via drill 0.6)
  Top 0.2: U$1.$50 46.78,45.65 v51.1,41.63 | v60.67,40.93 64.77,40.93 117.AO.1
  Bottom 0.2: v51.1,41.63 51.8,40.93 v60.67,40.93
N$25  (via drill 0.6)
  Top 0.2: v60.55,44.83 60.68,44.83 61.93,46.03 64.7,46.03 117.AI.1 | U$1.$48 39.11,44.85 39.6,44.23 v46.8,44.23
  Bottom 0.2: v46.8,44.23 47.5,44.83 v60.55,44.83
N$26  (via drill 0.6)
  Top 0.2: U$1.$27 29.92,41.22 29.23,40.66 29.23,39.91 v29.22,39.33 | 3.8,40.73 001.17CLK.1 3.8,40.53 5.8,40.53 v7.1,39.33
  Bottom 0.2: v7.1,39.33 v29.22,39.33
N$27  (via drill 0.6)
  Top 0.2: U$1.$26 29.52,41.66 28.4,40.83 28.4,38.23 v29.8,37.33 | v10.6,15.73 10.2,15.73 9.2,16.73 9.2,40.33 6.4,43.13 3.78,43.13 001.1-DATA.1
  Bottom 0.2: v10.6,15.73 28,15.73 28.6,16.33 28.6,36.33 v29.8,37.33 | 001.1-DATA.1 3.8,43.33
N$28  (via drill 0.6)
  Top 0.2: v17.5,46.23 18,46.84 27.59,46.85 U$1.$14 | v6.9,50.83 3.75,50.83 300.17-CLK.1
  Bottom 0.2: v17.5,46.23 9.8,46.23 9.4,46.63 9.4,50.03 8.5,50.83 v6.9,50.83
N$29  (via drill 0.6)
  Top 0.2: v25.5,65.68 25.5,66.38 26.25,67.13 701.1-DATA.1 | U$1.$87 28.73,55 28.2,55.53 25.5,55.53 v25.45,55.58
  Bottom 0.2: v25.45,55.58 25.45,65.03 v25.5,65.68
N$30  (via drill 0.6)
  Top 0.2: U$1.$15 18.72,46.45 17.4,45.03 v17.4,40.43 | 3.75,45.73 300.1-DATA.1 7.1,45.78 7.6,45.28 7.6,43.78 8.85,42.53 v9,42.53
  Bottom 0.2: v9,42.53 9,41.93 10.5,40.43 v17.4,40.43
N$31
  Top 0.2: U$1.$78 32.33,61.66 35.2,64.33 38.2,64.33 38.8,64.93 38.8,66.99 708.17-RX.1
N$32
  Top 0.2: U$1.$79 31.93,62.36 34.8,64.93 35.7,64.93 36.2,65.43 36.2,67.06 708.1-TX.1
N$33  (via drill 0.6)
  Top 0.2: U$1.$20 22.02,44.45 21,43.43 21,36.66 v19.97,35.93 | v6.8,35.93 4.65,35.93 3.8,36.78 3.8,38.08 100.17-TX.1
  Bottom 0.2: v6.8,35.93 v19.97,35.93
N$34  (via drill 0.6)
  Top 0.2: U$1.$18 20.92,45.25 v20,44.53 | 200.17-RX.1 v6.9,48.33
  Bottom 0.2: v6.9,48.33 8.4,48.33 8.7,48.03 8.7,45.23 9.4,44.53 v20,44.53
N$35  (via drill 0.6)
  Top 0.2: U$1.$7 13.98,49.65 v13.6,50.23 | GPIO-500.17.1 v8.42,53.43
  Bottom 0.2: v13.6,50.23 13.6,52.53 13,53.13 8.72,53.13 v8.42,53.43
N$36  (via drill 0.6)
  Top 0.2: U$1.$6 21.08,50.05 20.6,50.53 17.3,50.53 v17.2,50.43 | v15.4,54.73 6.8,54.73 5.6,55.93 3.7,55.93 GPIO-600.17.1
  Bottom 0.2: v15.4,54.73 15.4,50.83 15.9,50.43 v17.2,50.43
N$37  (via drill 0.6)
  Top 0.2: U$1.$52 49.88,46.45 v50.5,45.88 | v60.4,48.42 64.72,48.42 GPIO-317.17.1
  Bottom 0.2: v50.5,45.88 50.5,48.18 50.8,48.48 60.34,48.48 v60.4,48.42
N$38  (via drill 0.6)
  Top 0.2: U$1.$59 52.62,49.25 v53.8,51.13 | v60.95,51.13 64.48,51.13 GPIO-417.7.1
  Bottom 0.2: v53.8,51.13 v60.95,51.13
N$39
  Top 0.2: U$1.$71 35.12,55.86 36.8,57.53 39.4,57.53 42.6,60.73 50.8,60.73 51.4,61.33 GPIO-715.17.1
N$40  (via drill 0.6)
  Top 0.2: U$1.$60 47.52,49.65 v50,52.73 | v60.67,53.8 64.56,53.8 GPIO-517.17.1
  Bottom 0.2: v60.67,53.8 51.07,53.8 v50,52.73
N$41  (via drill 0.6)
  Top 0.2: U$1.$51 48.28,46.05 v50.8,43.63 | v61.47,42.93 64.28,42.93 GPIO-217.17.1
  Bottom 0.2: v50.8,43.63 50.8,43.53 51.4,42.93 v61.47,42.93